# Altium project ControlBoard.PrjPcb (part 2 of 8)

## Sheet CAN.SchDoc: Title
size A4; SchTemplateVer: V2.0; Author: Adam Mizerkiewicz; CompanyName: Adam Mizerkiewicz; DrawnBy: Adam Mizerkiewicz; Engineer: Adam Mizerkiewicz; Organization: Adam Mizerkiewicz; Address1: Sarnia 2/19; Address2: 61-058 Poznań; Revision: 0.0; SheetNumber: 12; SheetTotal: 18
Used 2 times, as channels TOP/U_CAN, TOP/U_CAN. Parts and nets are listed once, with the designators drawn on the sheet.
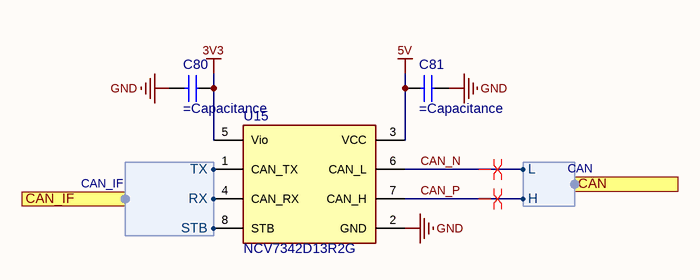
[diagram p4: CAN.SchDoc]

### Parts
C80  (no value)  [C0402]
C81  (no value)  [C0402]
U15  NCV7342D13R2G  [SOIC8]

### Ports
CAN (harness CAN), CAN_IF (harness CAN_IF)

### Harnesses
CAN_IF: RX, TX, STB
CAN: H, L

### Nets
3V3: C80.1 U15.5(Vio)
5V: C81.2 U15.3(VCC)
GND: C80.2 C81.1 U15.2(GND)
CAN_N: U15.6(CAN_L) ; port CAN.L
CAN_P: U15.7(CAN_H) ; port CAN.H
NetU15_1: U15.1(CAN_TX) ; port CAN_IF.TX
NetU15_4: U15.4(CAN_RX) ; port CAN_IF.RX
NetU15_8: U15.8(STB) ; port CAN_IF.STB

### Channels
TOP/U_CAN: designators end in _TOP_U_CAN#1
TOP/U_CAN: designators end in _TOP_U_CAN#2

### Layout directives
differential pair; differential pair class CAN: CAN_N, CAN_P

### Notes on the sheet
- Revision
  =Revision
- Sheet
  =SheetNumber / =SheetTotal

### Library data of the parts
C80 C81 = CAP0402-0.1uF-50V: CAP CER 0.1UF 50V X7R 0402; Manufacturer: Walsin Technologies; Manufacturer Part Number: 0402B104K500CT; Capacitance: 100nF; Material: 4241ConductorMaterial; Value: 100nF; Tolerance: 10%; Dielectric: 1511DielectricType; Supplier: Digikey; Supplier Part Number: 1292-1176-1-ND; RoHS: Yes; Category: Ceramic Capacitors; Stock: 109567; Pricing: 1=0,08, 10=0,005, 100=0,0032, 1000=0,0024 (USD); Mounting Technology: Surface Mount; Case/Package: 0402; Case Code (Imperial): 0402; Case Code (Metric): 1005; Min Operating Temperature: -55°C; Max Operating Temperature: 125°C; Packaging: Cut Tape; Voltage Rating: 50V; Series: -; Voltage Rating (DC): 50V; Height: 550um; RoHS Compliant: Yes; Lead Free: 5697LeadFree; ComponentLink1URL: http://datasheet.octopart.com/0402B104K500CT-Walsin-Technologies-datasheet-26371553.pdf?src-supplier=Arrow+Electronics; ComponentLink1Description: http://datasheet.octopart.com/0402B104K500CT-Walsin-Technologies-datasheet-26371553.pdf?src-supplier=Arrow+Electronics; ComponentLink2URL: http://datasheet.octopart.com/0402B104K500CT-Walsin-Technologies-datasheet-26371553.pdf?src-supplier=Verical; ComponentLink2Description: http://datasheet.octopart.com/0402B104K500CT-Walsin-Technologies-datasheet-26371553.pdf?src-supplier=Verical; ComponentLink3URL: http://www.passivecomponent.com/indexsea/0402B104K500CT-IE.pdf?src-supplier=Digikey; ComponentLink3Description: http://www.passivecomponent.com/indexsea/0402B104K500CT-IE.pdf?src-supplier=Digikey; ComponentLink4URL: http://datasheet.octopart.com/0402B104K500CT-Walsin-Technologies-datasheet-26371553.pdf?src-supplier=Rs; ComponentLink4Description: http://datasheet.octopart.com/0402B104K500CT-Walsin-Technologies-datasheet-26371553.pdf?src-supplier=Rs; ComponentLink5URL: https://datasheet.octopart.com/0402B104K500CT-Walsin-Technologies-datasheet-128065749.pdf?src-supplier=Future+Electronics; ComponentLink5Description: https://datasheet.octopart.com/0402B104K500CT-Walsin-Technologies-datasheet-128065749.pdf?src-supplier=Future+Electronics; ComponentLink6URL: http://datasheet.octopart.com/0402B104K500CT-Walsin-Technologies-datasheet-26371553.pdf?src-supplier=Farnell; ComponentLink6Description: http://datasheet.octopart.com/0402B104K500CT-Walsin-Technologies-datasheet-26371553.pdf?src-supplier=Farnell; ComponentLink7URL: http://datasheet.octopart.com/0402B104K500CT-Walsin-Technologies-datasheet-26371553.pdf?src-supplier=Newark; ComponentLink7Description: http://datasheet.octopart.com/0402B104K500CT-Walsin-Technologies-datasheet-26371553.pdf?src-supplier=Newark; ComponentLink8URL: http://datasheet.octopart.com/0402B104K500CT-Walsin-Technologies-datasheet-26371553.pdf?src-supplier=Mouser; ComponentLink8Description: http://datasheet.octopart.com/0402B104K500CT-Walsin-Technologies-datasheet-26371553.pdf?src-supplier=Mouser; ComponentLink9URL: http://datasheet.octopart.com/0402B104K500CT-Walsin-Technologies-datasheet-26371553.pdf?src-supplier=Digikey; ComponentLink9Description: http://datasheet.octopart.com/0402B104K500CT-Walsin-Technologies-datasheet-26371553.pdf?src-supplier=Digikey; ComponentLink10URL: https://datasheet.octopart.com/0402B104K500CT-Walsin-Technologies-datasheet-62066062.pdf?src-supplier=TME; ComponentLink10Description: https://datasheet.octopart.com/0402B104K500CT-Walsin-Technologies-datasheet-62066062.pdf?src-supplier=TME; ComponentLink11URL: http://datasheet.octopart.com/0402B104K500CT-Walsin-Technologies-datasheet-26371553.pdf?src-supplier=Freelance+Electronics; ComponentLink11Description: http://datasheet.octopart.com/0402B104K500CT-Walsin-Technologies-datasheet-26371553.pdf?src-supplier=Freelance+Electronics; ComponentLink12URL: http://datasheet.octopart.com/0402B104K500CT-Walsin-Technologies-datasheet-26371553.pdf?src-supplier=Component+Sense; ComponentLink12Description: http://datasheet.octopart.com/0402B104K500CT-Walsin-Technologies-datasheet-26371553.pdf?src-supplier=Component+Sense; ComponentLink13URL: http://datasheet.octopart.com/0402B104K500CT-Walsin-Technologies-datasheet-26371553.pdf?src-supplier=NAC+Semi; ComponentLink13Description: http://datasheet.octopart.com/0402B104K500CT-Walsin-Technologies-datasheet-26371553.pdf?src-supplier=NAC+Semi; ComponentLink14URL: https://datasheet.octopart.com/0402B104K500CT-Walsin-Technologies-datasheet-136037192.pdf?src-supplier=TECHDesign; ComponentLink14Description: https://datasheet.octopart.com/0402B104K500CT-Walsin-Technologies-datasheet-136037192.pdf?src-supplier=TECHDesign; Supplier 1: Digikey; Supplier Part Number 1: 1292-1176-1-ND
U15 = NCV7342D13R2G: IC TRANSCEIVER HALF 1/1 8SOIC; Manufacturer: ON Semiconductor; Data Rate: 1Mbps; Max Supply Voltage: 5.5V; Min Supply Voltage: 4.5V; Number of Transceivers: 1; Supplier 1: Digi-Key; Manufacturer Part Number: NCV7342D13R2G; RoHS: Yes; Category: Interface ICs; Pricing 1: 1=0.95000, 10=0.85000, 25=0.80680, 100=0.66290, 250=0.61968, 500=0.54760, 1000=0.47582 (USD); Mount: Surface Mount; Case/Package: SOIC; Number of Pins: 8; Min Operating Temperature: -40°C; Max Operating Temperature: 125°C; Packaging: Tape and Reel; Package Quantity: 3000; Lead Free: Lead Free; RoHS Compliant: Yes; ComponentLink1URL: http://www.farnell.com/datasheets/2160795.pdf?src-supplier=Farnell; ComponentLink1Description: http://www.farnell.com/datasheets/2160795.pdf?src-supplier=Farnell; ComponentLink2URL: http://www.mouser.com/ds/2/308/NCV7342-D-269211.pdf?src-supplier=Mouser; ComponentLink2Description: http://www.mouser.com/ds/2/308/NCV7342-D-269211.pdf?src-supplier=Mouser; ComponentLink3URL: http://www.onsemi.com/pub/Collateral/NCV7342-D.PDF?src-supplier=Digi-Key; ComponentLink3Description: http://www.onsemi.com/pub/Collateral/NCV7342-D.PDF?src-supplier=Digi-Key; ComponentLink4URL: http://www.onsemi.com/pub_link/Collateral/NCV7342-D.PDF?src-supplier=Avnet; ComponentLink4Description: http://www.onsemi.com/pub_link/Collateral/NCV7342-D.PDF?src-supplier=Avnet; ComponentLink5URL: http://www.farnell.com/datasheets/2160795.pdf?src-supplier=Newark; ComponentLink5Description: http://www.farnell.com/datasheets/2160795.pdf?src-supplier=Newark; ComponentLink6URL: http://www.farnell.com/datasheets/2160795.pdf?src-supplier=Element14; ComponentLink6Description: http://www.farnell.com/datasheets/2160795.pdf?src-supplier=Element14; Supplier Part Number 1: NCV7342D13R2GOSCT-ND

## Sheet DIgitalInputs.SchDoc: Title
size A4; SchTemplateVer: V2.0; Author: Adam Mizerkiewicz; CompanyName: Adam Mizerkiewicz; DrawnBy: Adam Mizerkiewicz; Engineer: Adam Mizerkiewicz; Organization: Adam Mizerkiewicz; Address1: Sarnia 2/19; Address2: 61-058 Poznań; Revision: 0.0; SheetNumber: 7; SheetTotal: 17
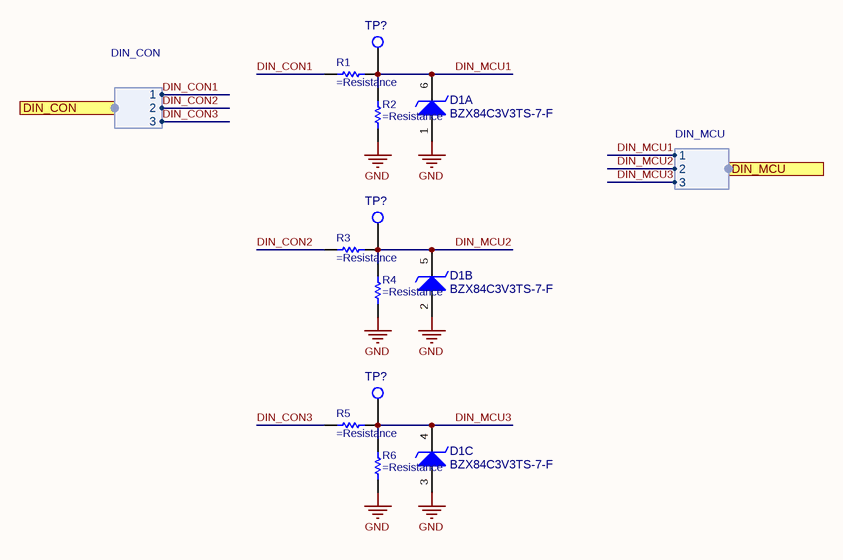
[diagram p5: DIgitalInputs.SchDoc]

### Parts
(Parts that share a designator on the sheet are numbered #1, #2 ... from top to bottom, then left to right.)
D1  BZX84C3V3TS-7-F  [SOT-363]  (parts A,B,C of 3)
R1  (no value)  [R0402]
R2  (no value)  [R0402]
R3  (no value)  [R0402]
R4  (no value)  [R0402]
R5  (no value)  [R0402]
R6  (no value)  [R0402]
TP?#1  TP_SMT  [TP_SMT]  (value not drawn)  (no BOM)
TP?#2  TP_SMT  [TP_SMT]  (value not drawn)  (no BOM)
TP?#3  TP_SMT  [TP_SMT]  (value not drawn)  (no BOM)

### Ports
DIN_CON (harness DIN_CON), DIN_MCU (harness DIN_MCU)

### Harnesses
DIN_MCU: 1, 2, 3
DIN_CON: 1, 2, 3

### Nets
GND: D1.1(A1) D1.2(A2) D1.3(A3) R2.1 R4.1 R6.1
DIN_CON1: R1.1 ; port DIN_CON.1
DIN_CON2: R3.1 ; port DIN_CON.2
DIN_CON3: R5.1 ; port DIN_CON.3
DIN_MCU1: D1.6(C1) R1.2 R2.2 TP?#1.1 ; port DIN_MCU.1
DIN_MCU2: D1.5(C2) R3.2 R4.2 TP?#2.1 ; port DIN_MCU.2
DIN_MCU3: D1.4(C3) R5.2 R6.2 TP?#3.1 ; port DIN_MCU.3

### Notes on the sheet
- Revision
  =Revision
- Sheet
  =SheetNumber / =SheetTotal

### Library data of the parts
D1 = BZX84C3V3TS-7-F: DIODE ZENER ARRAY 3.3V SOT-363; Manufacturer: Diodes Inc.; ESD Protection: No; Forward Voltage: 900mV; Impedance: 95Ω; Max Power Dissipation: 200mW; Max Reverse Leakage Current: 5µA; Number of Elements: 3; Polarity: Unidirectional; Reverse Standoff Voltage: 1V; Test Current: 5mA; Tolerance: 6%; Voltage Tolerance: 6.06%; Supplier 1: DigiKey; Supplier Part Number 1: 31-BZX84C3V3TS-7-FCT-ND; Supplier: DigiKey; Supplier Part Number: 31-BZX84C3V3TS-7-FCT-ND; Manufacturer Part Number: BZX84C3V3TS-7-F; RoHS: Compliant; Category: Zener Diodes; Stock: 2827; Pricing: 1=0,31, 10=0,213, 100=0,099 (USD); Case/Package: SOT-363; China RoHS: Compliant; Contact Plating: Tin; Height: 1mm; Length: 2.2mm; Lifecycle Status: Production; Max Operating Temperature: 150°C; Min Operating Temperature: -65°C; Mounting Technology: Surface Mount; Pins: 6; Number of Terminals: 6; Packaging: Tape & Reel; Peak Reverse Current: 5µA; Power Dissipation: 200mW; Power Rating: 200mW; REACH SVHC: Yes; Reference Voltage: 3.3V; Weight: 6.010099mg; Width: 2.2mm; Zener Current: 5mA; Zener Voltage: 3.3V; ComponentLink1URL: https://datasheet.octopart.com:443/BZX84C3V3TS-7-F-Diodes-Inc.-datasheet-160640132.pdf?src-supplier=IHS; ComponentLink1Description: https://datasheet.octopart.com:443/BZX84C3V3TS-7-F-Diodes-Inc.-datasheet-160640132.pdf?src-supplier=IHS; ComponentLink2URL: https://datasheet.octopart.com:443/BZX84C3V3TS-7-F-Diodes-Inc.-datasheet-11551317.pdf?src-supplier=Diodes+Inc+SCT; ComponentLink2Description: https://datasheet.octopart.com:443/BZX84C3V3TS-7-F-Diodes-Inc.-datasheet-11551317.pdf?src-supplier=Diodes+Inc+SCT; ComponentLink3URL: https://sigma.octopart.com:443/138865995/technical_drawing/Diodes-Inc.-BZX84C3V3TS-7-F.pdf?src-supplier=Diodes+Inc+SCT; ComponentLink3Description: https://sigma.octopart.com:443/138865995/technical_drawing/Diodes-Inc.-BZX84C3V3TS-7-F.pdf?src-supplier=Diodes+Inc+SCT; ComponentLink4URL: http://sigma.octopart.com:80/15616913/materials_sheet/Diodes-Inc.-BZX84C3V3TS-7-F.pdf?src-supplier=Compliance+Statements; ComponentLink4Description: http://sigma.octopart.com:80/15616913/materials_sheet/Diodes-Inc.-BZX84C3V3TS-7-F.pdf?src-supplier=Compliance+Statements
R1-R6 = RES0402-30k-1%: 0402 30K Ohms 1% High Power Thick Film Surface Mount Chip Resistor; Manufacturer: Vishay; Manufacturer Part Number: CRCW040230K0FKEDHP; Manufacturer Package Identifier: CRCW0402-HPe3; Resistance: 30kΩ; Max Power Dissipation: 125mW; Power Dissipation: 200mW; Value: 30kΩ; Temperature Coefficient: 100ppm/°C; Voltage Rating: 50V; Supplier 1: DigiKey; Supplier Part Number 1: CRCW040230K0FKEDHPCT-ND; Supplier: DigiKey; Supplier Part Number: CRCW040230K0FKEDHPCT-ND; RoHS: Compliant; Category: Chip SMD Resistors; Stock: 9449; Pricing: 1=0,13, 10=0,061, 25=0,0472, 50=0,0392, 100=0,0331, 250=0,027, 500=0,0235, 1000=0,02072, 5000=0,01631 (USD); Case/Package: 0402; Case Code (Imperial): 0402; Case Code (Metric): 1005; China RoHS: Non-Compliant; Composition: Thick Film; Contact Plating: Tin; Features: Automotive AEC-Q200; Height: 300µm; Lead Free: Lead Free; Length: 990.6µm; Lifecycle Status: Production; Max Operating Temperature: 155°C; Min Operating Temperature: -55°C; Mounting Technology: Surface Mount; Number of Terminals: 2; Number of Terminations: 2; Packaging: Digi-Reel®; Power Rating: 200mW; Radiation Hardening: No; REACH SVHC: Yes; Tolerance: 1%; Width: 500µm; Working Voltage: 50V; ComponentLink1URL: https://datasheet.octopart.com/CRCW040230K0FKEDHP-Vishay-datasheet-83567917.pdf; ComponentLink1Description: https://datasheet.octopart.com/CRCW040230K0FKEDHP-Vishay-datasheet-83567917.pdf; ComponentLink2URL: https://datasheet.octopart.com/D-CRCW-e3-Standard-Thick-Film-Chip-Resistors-Vishay-datasheet-family-64.pdf; ComponentLink2Description: https://datasheet.octopart.com/D-CRCW-e3-Standard-Thick-Film-Chip-Resistors-Vishay-datasheet-family-64.pdf; ComponentLink3URL: https://datasheet.octopart.com:443/CRCW040230K0FKEDHP-Vishay-datasheet-137113427.pdf?src-supplier=X-ON; ComponentLink3Description: https://datasheet.octopart.com:443/CRCW040230K0FKEDHP-Vishay-datasheet-137113427.pdf?src-supplier=X-ON; ComponentLink4URL: https://datasheet.octopart.com:443/CRCW040230K0FKEDHP-Vishay-datasheet-62316122.pdf?src-supplier=Future+Electronics; ComponentLink4Description: https://datasheet.octopart.com:443/CRCW040230K0FKEDHP-Vishay-datasheet-62316122.pdf?src-supplier=Future+Electronics; ComponentLink5URL: http://sigma.octopart.com:80/rohs_certificate/D-CRCW-e3-Standard-Thick-Film-Chip-Resistors-Vishay-family-102.pdf?src-supplier=Compliance+Statements; ComponentLink5Description: http://sigma.octopart.com:80/rohs_certificate/D-CRCW-e3-Standard-Thick-Film-Chip-Resistors-Vishay-family-102.pdf?src-supplier=Compliance+Statements
TP?#1-TP?#3 = TP: TEST POINT

## Sheet DigitalOutputs.SchDoc: Title
size A4; SchTemplateVer: V2.0; Author: Adam Mizerkiewicz; CompanyName: Adam Mizerkiewicz; DrawnBy: Adam Mizerkiewicz; Engineer: Adam Mizerkiewicz; Organization: Adam Mizerkiewicz; Address1: Sarnia 2/19; Address2: 61-058 Poznań; Revision: 0.0
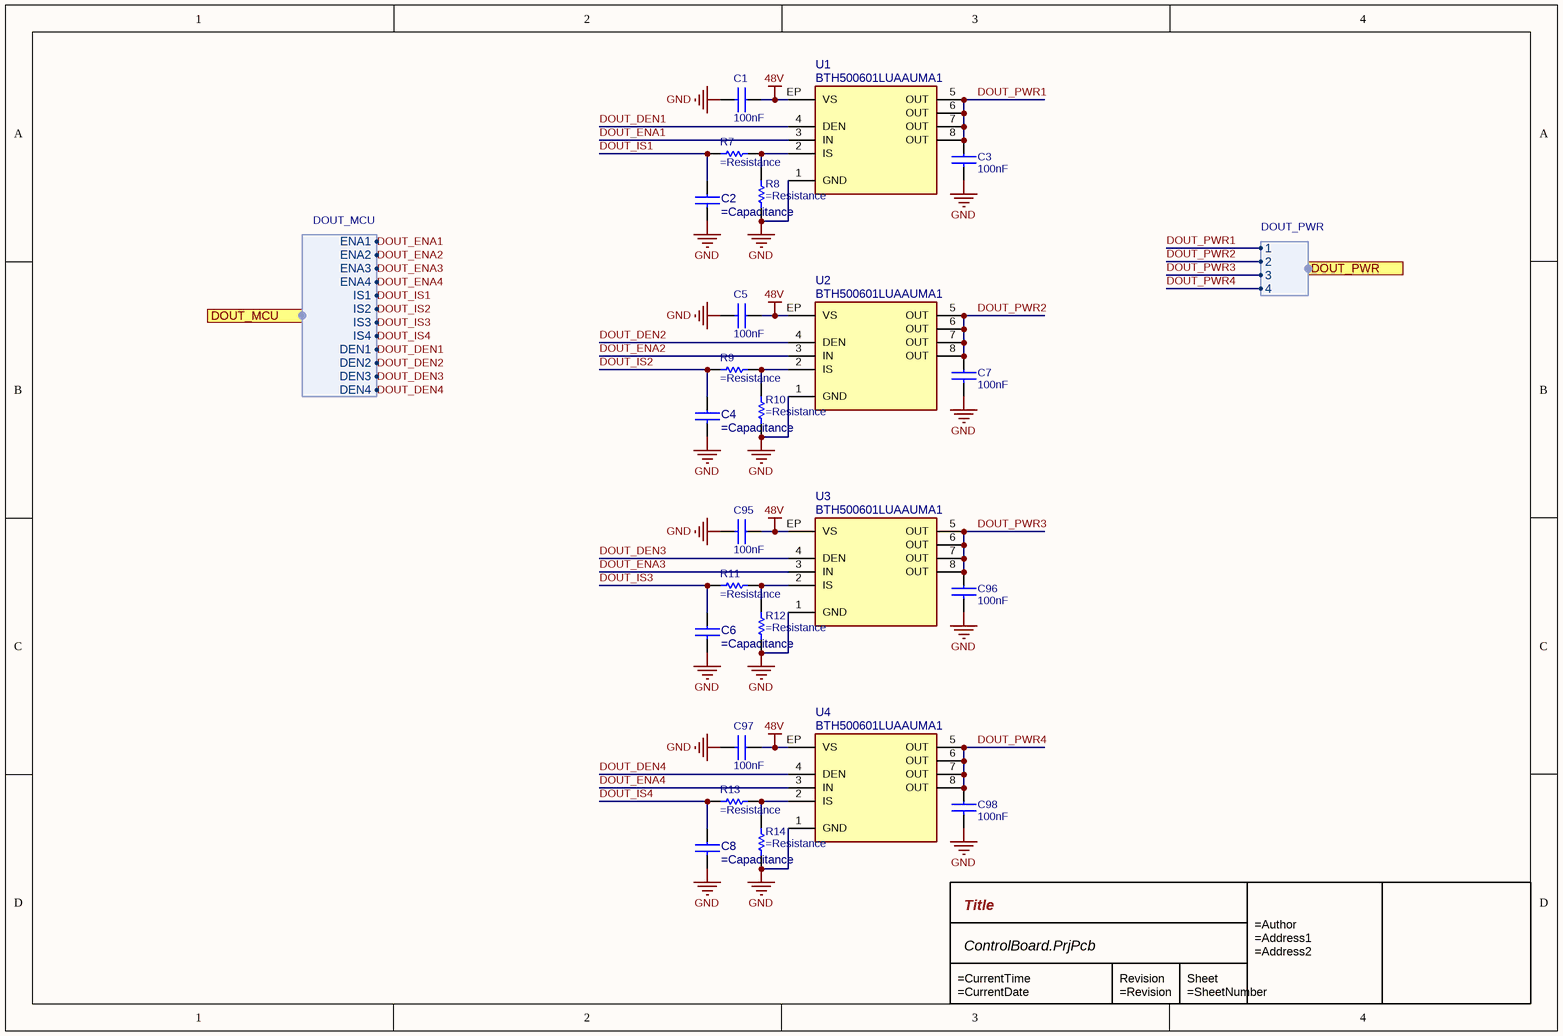
[diagram p6: DigitalOutputs.SchDoc]

### Parts
C1  100nF  [C0603]
C2  (no value)  [C0402]
C3  100nF  [C0603]
C4  (no value)  [C0402]
C5  100nF  [C0603]
C6  (no value)  [C0402]
C7  100nF  [C0603]
C8  (no value)  [C0402]
C95  100nF  [C0603]
C96  100nF  [C0603]
C97  100nF  [C0603]
C98  100nF  [C0603]
R7  (no value)  [R0402]
R8  (no value)  [R0402]
R9  (no value)  [R0402]
R10  (no value)  [R0402]
R11  (no value)  [R0402]
R12  (no value)  [R0402]
R13  (no value)  [R0402]
R14  (no value)  [R0402]
U1  BTH500601LUAAUMA1  [PG-HSOF-8-1]
U2  BTH500601LUAAUMA1  [PG-HSOF-8-1]
U3  BTH500601LUAAUMA1  [PG-HSOF-8-1]
U4  BTH500601LUAAUMA1  [PG-HSOF-8-1]

### Ports
DOUT_MCU (harness DOUT_MCU), DOUT_PWR (harness DOUT_PWR)

### Harnesses
DOUT_MCU: ENA1, DEN1, ENA2, ENA3, ENA4, IS1, IS2, IS3, IS4, DEN2, DEN3, DEN4
DOUT_PWR: 1, 2, 3, 4

### Nets
48V: C1.1 C5.1 C95.1 C97.1 U1.EP(VS) U2.EP(VS) U3.EP(VS) U4.EP(VS)
GND: C1.2 C2.2 C3.2 C4.2 C5.2 C6.2 C7.2 C8.2 C95.2 C96.2 C97.2 C98.2 R8.1 R10.1 R12.1 R14.1 U1.1(GND) U2.1(GND) U3.1(GND) U4.1(GND)
DOUT_DEN1: U1.4(DEN) ; port DOUT_MCU.DEN1
DOUT_DEN2: U2.4(DEN) ; port DOUT_MCU.DEN2
DOUT_DEN3: U3.4(DEN) ; port DOUT_MCU.DEN3
DOUT_DEN4: U4.4(DEN) ; port DOUT_MCU.DEN4
DOUT_ENA1: U1.3(IN) ; port DOUT_MCU.ENA1
DOUT_ENA2: U2.3(IN) ; port DOUT_MCU.ENA2
DOUT_ENA3: U3.3(IN) ; port DOUT_MCU.ENA3
DOUT_ENA4: U4.3(IN) ; port DOUT_MCU.ENA4
DOUT_IS1: C2.1 R7.1 ; port DOUT_MCU.IS1
DOUT_IS2: C4.1 R9.1 ; port DOUT_MCU.IS2
DOUT_IS3: C6.1 R11.1 ; port DOUT_MCU.IS3
DOUT_IS4: C8.1 R13.1 ; port DOUT_MCU.IS4
DOUT_PWR1: C3.1 U1.5(OUT) U1.6(OUT) U1.7(OUT) U1.8(OUT) ; port DOUT_PWR.1
DOUT_PWR2: C7.1 U2.5(OUT) U2.6(OUT) U2.7(OUT) U2.8(OUT) ; port DOUT_PWR.2
DOUT_PWR3: C96.1 U3.5(OUT) U3.6(OUT) U3.7(OUT) U3.8(OUT) ; port DOUT_PWR.3
DOUT_PWR4: C98.1 U4.5(OUT) U4.6(OUT) U4.7(OUT) U4.8(OUT) ; port DOUT_PWR.4
NetR7_2: R7.2 R8.2 U1.2(IS)
NetR9_2: R9.2 R10.2 U2.2(IS)
NetR11_2: R11.2 R12.2 U3.2(IS)
NetR13_2: R13.2 R14.2 U4.2(IS)

### Notes on the sheet
- Revision
  =Revision
- Sheet
  =SheetNumber / =SheetTotal

### Library data of the parts
C1 C3 C5 C7 C95-C98 = CAP0603-0.1uF-100V: CAP CER 0.1UF 100V X7R 0603; Manufacturer: Yageo; Manufacturer Part Number: CC0603KRX7R0BB104; Material: 4241ConductorMaterial; Tolerance: 10%; Capacitance: 100nF; Supplier: Digikey; Supplier Part Number: 311-1523-1-ND; RoHS: Yes; Category: Ceramic Capacitors; Stock: 3495882; Pricing: 1=0,14, 10=0,079, 100=0,0484, 1000=0,0325 (USD); Mounting Technology: Surface Mount; Case/Package: 0603; Case Code (Metric): 1608; Case Code (Imperial): 0603; Weight: 7.1E-05oz; Min Operating Temperature: -55°C; Max Operating Temperature: 125°C; Value: 100nF; Voltage Rating: 100V; Packaging: Tape and Reel; Dielectric: X7R; Termination: SMD/SMT; Voltage Rating (DC): 100V; Package Quantity: 4000; Series: CC; Length: 0.063inch; Width: 0.031inch; Height: 900um; Thickness: 0.035inch; Lead Free: 5697LeadFree; RoHS Compliant: Yes; ComponentLink1URL: https://datasheet.ciiva.com/6277/mlccorderingcode-6277082.pdf?src-supplier=Digikey; ComponentLink1Description: https://datasheet.ciiva.com/6277/mlccorderingcode-6277082.pdf?src-supplier=Digikey; ComponentLink2URL: https://datasheet.ciiva.com/6277/mlccorderingcode-6277081.pdf?src-supplier=Digikey; ComponentLink2Description: https://datasheet.ciiva.com/6277/mlccorderingcode-6277081.pdf?src-supplier=Digikey; ComponentLink3URL: https://datasheet.ciiva.com/6277/mlccorderingcode-6277030.pdf?src-supplier=Digikey; ComponentLink3Description: https://datasheet.ciiva.com/6277/mlccorderingcode-6277030.pdf?src-supplier=Digikey; Supplier 1: Digikey; Supplier Part Number 1: 311-1523-1-ND
C2 C4 C6 C8 = CAP0402-0.1uF-50V: as C80 on sheet CAN; Supplier: Digikey; Supplier Part Number: 1292-1176-1-ND; RoHS: Yes; Category: Ceramic Capacitors; Stock: 109567; Pricing: 1=0,08, 10=0,005, 100=0,0032, 1000=0,0024 (USD); Mounting Technology: Surface Mount; Case/Package: 0402; Case Code (Imperial): 0402; Case Code (Metric): 1005; Min Operating Temperature: -55°C; Max Operating Temperature: 125°C; Packaging: Cut Tape; Voltage Rating: 50V; Series: -; Voltage Rating (DC): 50V; Height: 550um; RoHS Compliant: Yes; Lead Free: 5697LeadFree; ComponentLink1URL: http://datasheet.octopart.com/0402B104K500CT-Walsin-Technologies-datasheet-26371553.pdf?src-supplier=Arrow+Electronics; ComponentLink1Description: http://datasheet.octopart.com/0402B104K500CT-Walsin-Technologies-datasheet-26371553.pdf?src-supplier=Arrow+Electronics; ComponentLink2URL: http://datasheet.octopart.com/0402B104K500CT-Walsin-Technologies-datasheet-26371553.pdf?src-supplier=Verical; ComponentLink2Description: http://datasheet.octopart.com/0402B104K500CT-Walsin-Technologies-datasheet-26371553.pdf?src-supplier=Verical; ComponentLink3URL: http://www.passivecomponent.com/indexsea/0402B104K500CT-IE.pdf?src-supplier=Digikey; ComponentLink3Description: http://www.passivecomponent.com/indexsea/0402B104K500CT-IE.pdf?src-supplier=Digikey; ComponentLink4URL: http://datasheet.octopart.com/0402B104K500CT-Walsin-Technologies-datasheet-26371553.pdf?src-supplier=Rs; ComponentLink4Description: http://datasheet.octopart.com/0402B104K500CT-Walsin-Technologies-datasheet-26371553.pdf?src-supplier=Rs; ComponentLink5URL: https://datasheet.octopart.com/0402B104K500CT-Walsin-Technologies-datasheet-128065749.pdf?src-supplier=Future+Electronics; ComponentLink5Description: https://datasheet.octopart.com/0402B104K500CT-Walsin-Technologies-datasheet-128065749.pdf?src-supplier=Future+Electronics; ComponentLink6URL: http://datasheet.octopart.com/0402B104K500CT-Walsin-Technologies-datasheet-26371553.pdf?src-supplier=Farnell; ComponentLink6Description: http://datasheet.octopart.com/0402B104K500CT-Walsin-Technologies-datasheet-26371553.pdf?src-supplier=Farnell; ComponentLink7URL: http://datasheet.octopart.com/0402B104K500CT-Walsin-Technologies-datasheet-26371553.pdf?src-supplier=Newark; ComponentLink7Description: http://datasheet.octopart.com/0402B104K500CT-Walsin-Technologies-datasheet-26371553.pdf?src-supplier=Newark; ComponentLink8URL: http://datasheet.octopart.com/0402B104K500CT-Walsin-Technologies-datasheet-26371553.pdf?src-supplier=Mouser; ComponentLink8Description: http://datasheet.octopart.com/0402B104K500CT-Walsin-Technologies-datasheet-26371553.pdf?src-supplier=Mouser; ComponentLink9URL: http://datasheet.octopart.com/0402B104K500CT-Walsin-Technologies-datasheet-26371553.pdf?src-supplier=Digikey; ComponentLink9Description: http://datasheet.octopart.com/0402B104K500CT-Walsin-Technologies-datasheet-26371553.pdf?src-supplier=Digikey; ComponentLink10URL: https://datasheet.octopart.com/0402B104K500CT-Walsin-Technologies-datasheet-62066062.pdf?src-supplier=TME; ComponentLink10Description: https://datasheet.octopart.com/0402B104K500CT-Walsin-Technologies-datasheet-62066062.pdf?src-supplier=TME; ComponentLink11URL: http://datasheet.octopart.com/0402B104K500CT-Walsin-Technologies-datasheet-26371553.pdf?src-supplier=Freelance+Electronics; ComponentLink11Description: http://datasheet.octopart.com/0402B104K500CT-Walsin-Technologies-datasheet-26371553.pdf?src-supplier=Freelance+Electronics; ComponentLink12URL: http://datasheet.octopart.com/0402B104K500CT-Walsin-Technologies-datasheet-26371553.pdf?src-supplier=Component+Sense; ComponentLink12Description: http://datasheet.octopart.com/0402B104K500CT-Walsin-Technologies-datasheet-26371553.pdf?src-supplier=Component+Sense; ComponentLink13URL: http://datasheet.octopart.com/0402B104K500CT-Walsin-Technologies-datasheet-26371553.pdf?src-supplier=NAC+Semi; ComponentLink13Description: http://datasheet.octopart.com/0402B104K500CT-Walsin-Technologies-datasheet-26371553.pdf?src-supplier=NAC+Semi; ComponentLink14URL: https://datasheet.octopart.com/0402B104K500CT-Walsin-Technologies-datasheet-136037192.pdf?src-supplier=TECHDesign; ComponentLink14Description: https://datasheet.octopart.com/0402B104K500CT-Walsin-Technologies-datasheet-136037192.pdf?src-supplier=TECHDesign; Supplier 1: Digikey; Supplier Part Number 1: 1292-1176-1-ND
R7 R9 R11 R13 = RES0402-1k-1%: Res Thick Film 0402 1K Ohm 1% 0.063W(1/16W) ±50ppm/C Pad SMD Automotive T/R; Manufacturer: Vishay; Manufacturer Part Number: CRCW04021K00FHEDP; Resistance: 1kΩ; Max Power Dissipation: 63mW; Value: 1kΩ; Temperature Coefficient: 50ppm/°C; Voltage Rating: 50V; Supplier 1: DigiKey; Supplier Part Number 1: CRCW04021K00FHEDP-ND; Supplier: DigiKey; Supplier Part Number: CRCW04021K00FHEDP-ND; RoHS: Compliant; Category: Chip SMD Resistors; Pricing: 10000=0,03252 (USD); Case/Package: 0402; China RoHS: Non-Compliant; Composition: Thick Film; Contact Plating: Tin; Depth: 500µm; Features: Automotive AEC-Q200; Height: 350µm; Length: 990.6µm; Lifecycle Status: Production; Max Operating Temperature: 155°C; Military Standard: Not; Min Operating Temperature: -55°C; Mounting Technology: Surface Mount; Number of Terminals: 2; Number of Terminations: 2; Packaging: Tape & Reel; Power Dissipation: 63mW; Power Rating: 63mW; Radiation Hardening: No; REACH SVHC: Yes; Tolerance: 1%; Width: 500µm; Working Voltage: 50V; ComponentLink1URL: https://datasheet.octopart.com:443/CRCW04021K00FHEDP-Vishay-datasheet-182027415.pdf?src-supplier=IHS; ComponentLink1Description: https://datasheet.octopart.com:443/CRCW04021K00FHEDP-Vishay-datasheet-182027415.pdf?src-supplier=IHS; ComponentLink2URL: https://datasheet.octopart.com:443/CRCW04021K00FHEDP-Vishay-Dale-datasheet-141207190.pdf?src-supplier=Upverter; ComponentLink2Description: https://datasheet.octopart.com:443/CRCW04021K00FHEDP-Vishay-Dale-datasheet-141207190.pdf?src-supplier=Upverter; ComponentLink3URL: http://sigma.octopart.com:80/rohs_statement/Vishay-company-15.pdf?src-supplier=Compliance+Statements; ComponentLink3Description: http://sigma.octopart.com:80/rohs_statement/Vishay-company-15.pdf?src-supplier=Compliance+Statements
R8 R10 R12 R14 = RES0402-2k-1%: Res Thick Film 0402 2K Ohm 1% 1/16W 100ppm/C Molded SMD SMD Paper T/R; Manufacturer: Vishay; Manufacturer Part Number: CRCW04022K00FKEE; Resistance: 2kΩ; Max Power Dissipation: 63mW; Value: 2kΩ; Temperature Coefficient: 100ppm/°C; Voltage Rating: 50V; Supplier 1: DigiKey; Supplier Part Number 1: 541-CRCW04022K00FKEECT-ND; Supplier: DigiKey; Supplier Part Number: 541-CRCW04022K00FKEECT-ND; RoHS: Compliant; Category: Chip SMD Resistors; Stock: 10445; Pricing: 1=0,1, 10=0,03, 25=0,0224, 50=0,018, 100=0,0148, 250=0,01156, 500=0,01056, 1000=0,0084, 5000=0,00637 (USD); Case/Package: 0402; China RoHS: Non-Compliant; Composition: Thick Film; Contact Plating: Tin; Features: Automotive AEC-Q200; Height: 350µm; Lead Free: Lead Free; Length: 990.6µm; Lifecycle Status: Production; Max Operating Temperature: 155°C; Min Operating Temperature: -55°C; Mounting Technology: Surface Mount; Number of Terminals: 2; Number of Terminations: 2; Packaging: Tape & Reel; Power Dissipation: 63mW; Power Rating: 63mW; Radiation Hardening: No; REACH SVHC: Yes; Tolerance: 1%; Width: 500µm; Working Voltage: 50V; ComponentLink1URL: https://datasheet.octopart.com:443/CRCW04022K00FKEE-Vishay-datasheet-175423584.pdf?src-supplier=IHS; ComponentLink1Description: https://datasheet.octopart.com:443/CRCW04022K00FKEE-Vishay-datasheet-175423584.pdf?src-supplier=IHS; ComponentLink2URL: https://datasheet.octopart.com/D-CRCW-e3-Standard-Thick-Film-Chip-Resistors-Vishay-datasheet-family-64.pdf; ComponentLink2Description: https://datasheet.octopart.com/D-CRCW-e3-Standard-Thick-Film-Chip-Resistors-Vishay-datasheet-family-64.pdf; ComponentLink3URL: http://sigma.octopart.com:80/rohs_certificate/D-CRCW-e3-Standard-Thick-Film-Chip-Resistors-Vishay-family-102.pdf?src-supplier=Compliance+Statements; ComponentLink3Description: http://sigma.octopart.com:80/rohs_certificate/D-CRCW-e3-Standard-Thick-Film-Chip-Resistors-Vishay-family-102.pdf?src-supplier=Compliance+Statements
U1-U4 = BTH50060-1LUA: Power Load Sw, High Side, 150DEGC, HSOF8;; Manufacturer: Infineon; Supplier 1: DigiKey; Supplier Part Number 1: 448-BTH500601LUAAUMA1CT-ND; Supplier: DigiKey; Supplier Part Number: 448-BTH500601LUAAUMA1CT-ND; Manufacturer Part Number: BTH500601LUAAUMA1; Category: Power Switch ICs - Power Distribution; Stock: 3526; Pricing: 1=4,49, 10=3,408, 25=3,1372, 100=2,8399, 250=2,69812, 500=2,61266, 1000=2,54235 (USD); ComponentLink1URL: http://sigma.octopart.com:80/conflict_mineral_statement/Infineon-company-51.pdf?src-supplier=Compliance+Statements; ComponentLink1Description: http://sigma.octopart.com:80/conflict_mineral_statement/Infineon-company-51.pdf?src-supplier=Compliance+Statements

## Sheet ExternalConnectors.SchDoc: Title
size A4; SchTemplateVer: V2.0; Author: Adam Mizerkiewicz; CompanyName: Adam Mizerkiewicz; DrawnBy: Adam Mizerkiewicz; Engineer: Adam Mizerkiewicz; Organization: Adam Mizerkiewicz; Address1: Sarnia 2/19; Address2: 61-058 Poznań; Revision: 0.0
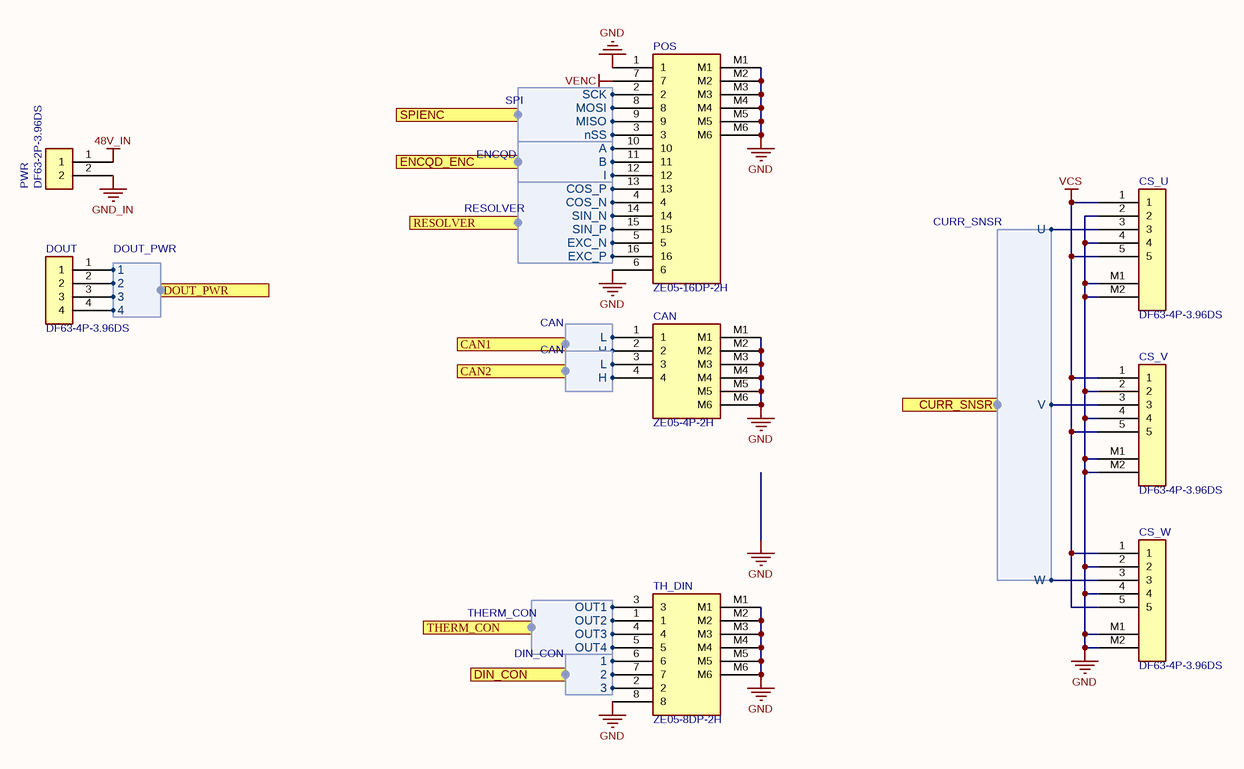
[diagram p7: ExternalConnectors.SchDoc]

### Parts
CAN  ZE05-4P-2H  [ZE05-4P-2H]
CS_U  DF63-4P-3.96DS  [FH34SRJ-5S-0.5SH(99)]
CS_V  DF63-4P-3.96DS  [FH34SRJ-5S-0.5SH(99)]
CS_W  DF63-4P-3.96DS  [FH34SRJ-5S-0.5SH(99)]
DOUT  DF63-4P-3.96DS  [HRS_DF63-4P-3.96DS]
POS  ZE05-16DP-2H  [ZE05-16DP-2H]
PWR  DF63-2P-3.96DS  [HRS_DF63-2P-3.96DS]
TH_DIN  ZE05-8DP-2H  [ZE05-8DP-2H]

### Ports
CAN1 (harness CAN), CAN2 (harness CAN), CURR_SNSR (harness CURR_SNSR), DIN_CON (harness DIN_CON), DOUT_PWR (harness DOUT_PWR), ENCQD_ENC (harness ENCQD), RESOLVER (harness RESOLVER), SPIENC (harness SPI), THERM_CON (harness THERM_CON)

### Harnesses
CAN: H, L
DOUT_PWR: 1, 2, 3, 4
ENCQD: B, A, I
SPI: MISO, MOSI, SCK, nSS
RESOLVER: EXC_P, EXC_N, SIN_P, SIN_N, COS_P, COS_N
CURR_SNSR: V, U, W
THERM_CON: OUT1, OUT2, OUT3, OUT4
DIN_CON: 1, 2, 3

### Nets
48V_IN: PWR.1
GND: CAN.M1 CAN.M2 CAN.M3 CAN.M4 CAN.M5 CAN.M6 CS_U.2 CS_U.4 CS_U.M1 CS_U.M2 CS_V.2 CS_V.4 CS_V.M1 CS_V.M2 CS_W.2 CS_W.4 CS_W.M1 CS_W.M2 POS.1 POS.6 POS.M1 POS.M2 POS.M3 POS.M4 POS.M5 POS.M6 TH_DIN.8 TH_DIN.M1 TH_DIN.M2 TH_DIN.M3 TH_DIN.M4 TH_DIN.M5 TH_DIN.M6
GND_IN: PWR.2
VCS: CS_U.1 CS_U.5 CS_V.1 CS_V.5 CS_W.1 CS_W.5
VENC: POS.7
CURR_SNSR_U: CS_U.3 ; port CURR_SNSR.U
CURR_SNSR_V: CS_V.3 ; port CURR_SNSR.V
CURR_SNSR_W: CS_W.3 ; port CURR_SNSR.W
DIN_CON1: TH_DIN.6 ; port DIN_CON.1
DIN_CON2: TH_DIN.7 ; port DIN_CON.2
DIN_CON3: TH_DIN.2 ; port DIN_CON.3
DOUT_PWR1: DOUT.1 ; port DOUT_PWR.1
DOUT_PWR2: DOUT.2 ; port DOUT_PWR.2
DOUT_PWR3: DOUT.3 ; port DOUT_PWR.3
DOUT_PWR4: DOUT.4 ; port DOUT_PWR.4
ENCQD_ENC_A: POS.10 ; port ENCQD_ENC.A
ENCQD_ENC_B: POS.11 ; port ENCQD_ENC.B
ENCQD_ENC_I: POS.12 ; port ENCQD_ENC.I
RES_COS_N: POS.4 ; port RESOLVER.COS_N
RES_COS_P: POS.13 ; port RESOLVER.COS_P
RES_EXC_N: POS.5 ; port RESOLVER.EXC_N
RES_EXC_P: POS.16 ; port RESOLVER.EXC_P
RES_SIN_N: POS.14 ; port RESOLVER.SIN_N
RES_SIN_P: POS.15 ; port RESOLVER.SIN_P
SPIENC_MISO: POS.9 ; port SPIENC.MISO
SPIENC_MOSI: POS.8 ; port SPIENC.MOSI
SPIENC_nSS: POS.3 ; port SPIENC.nSS
SPIENC_SCK: POS.2 ; port SPIENC.SCK
THERM_OUT1: TH_DIN.3 ; port THERM_CON.OUT1
THERM_OUT2: TH_DIN.1 ; port THERM_CON.OUT2
THERM_OUT3: TH_DIN.4 ; port THERM_CON.OUT3
THERM_OUT4: TH_DIN.5 ; port THERM_CON.OUT4
NetCAN_1: CAN.1 ; port CAN1.L
NetCAN_2: CAN.2 ; port CAN1.H
NetCAN_3: CAN.3 ; port CAN2.L
NetCAN_4: CAN.4 ; port CAN2.H

### Notes on the sheet
- Revision
  =Revision
- Sheet
  =SheetNumber / =SheetTotal

### Library data of the parts
CAN = ZE05-4P-2H: Automotive Connectors Right Angle Receptacle, DIP Solder Tabs, 4 Position; Manufacturer: HIROSE ELECTRIC; Supplier 1: DigiKey; Supplier Part Number 1: 26-ZE05-4P-2HCT-ND; Supplier: DigiKey; Supplier Part Number: 26-ZE05-4P-2HCT-ND; Manufacturer Part Number: ZE05-4P-2H; RoHS: Compliant; Category: Card Edge Connectors; Stock: 351; Pricing: 1=1,69, 10=1,434, 25=1,3444, 50=1,28, 100=1,2188 (USD); Connector Type: Receptacle; Contact Plating: Tin; Height: 8.34mm; Length: 16.32mm; Lifecycle Status: Production; Max Operating Temperature: 125°C; Min Operating Temperature: -40°C; Pins: 4; Orientation: Right Angle; REACH SVHC: Yes; Width: 14.8mm; ComponentLink1URL: https://datasheet.octopart.com:443/ZE05-4P-2H-HIROSE-ELECTRIC-datasheet-180012703.pdf?src-supplier=IHS; ComponentLink1Description: https://datasheet.octopart.com:443/ZE05-4P-2H-HIROSE-ELECTRIC-datasheet-180012703.pdf?src-supplier=IHS; ComponentLink2URL: https://datasheet.octopart.com:443/ZE05-4P-2H-HIROSE-ELECTRIC-datasheet-189101943.pdf?src-supplier=Master+Electronics; ComponentLink2Description: https://datasheet.octopart.com:443/ZE05-4P-2H-HIROSE-ELECTRIC-datasheet-189101943.pdf?src-supplier=Master+Electronics; ComponentLink3URL: https://datasheet.octopart.com:443/ZE05-4P-2H-HIROSE-ELECTRIC-datasheet-188748195.pdf?src-supplier=Master+Electronics; ComponentLink3Description: https://datasheet.octopart.com:443/ZE05-4P-2H-HIROSE-ELECTRIC-datasheet-188748195.pdf?src-supplier=Master+Electronics; ComponentLink4URL: https://datasheet.octopart.com:443/ZE05-4P-2H-HIROSE-ELECTRIC-datasheet-181928072.pdf?src-supplier=Electro+Sonic; ComponentLink4Description: https://datasheet.octopart.com:443/ZE05-4P-2H-HIROSE-ELECTRIC-datasheet-181928072.pdf?src-supplier=Electro+Sonic; ComponentLink5URL: https://datasheet.octopart.com:443/ZE05-4P-2H-HIROSE-ELECTRIC-datasheet-176457996.pdf?src-supplier=Future+Electronics; ComponentLink5Description: https://datasheet.octopart.com:443/ZE05-4P-2H-HIROSE-ELECTRIC-datasheet-176457996.pdf?src-supplier=Future+Electronics; ComponentLink6URL: https://datasheet.octopart.com:443/ZE05-4P-2H-Hirose-datasheet-168215454.pdf?src-supplier=TME; ComponentLink6Description: https://datasheet.octopart.com:443/ZE05-4P-2H-Hirose-datasheet-168215454.pdf?src-supplier=TME; ComponentLink7URL: https://datasheet.octopart.com:443/ZE05-4P-2H-Hirose-datasheet-149155786.pdf?src-supplier=Sager+Electronics; ComponentLink7Description: https://datasheet.octopart.com:443/ZE05-4P-2H-Hirose-datasheet-149155786.pdf?src-supplier=Sager+Electronics; ComponentLink8URL: https://datasheet.octopart.com:443/ZE05-4P-2H-Hirose-datasheet-137351164.pdf?src-supplier=Sager+Electronics; ComponentLink8Description: https://datasheet.octopart.com:443/ZE05-4P-2H-Hirose-datasheet-137351164.pdf?src-supplier=Sager+Electronics; ComponentLink9URL: https://sigma.octopart.com:443/145369994/technical_drawing/Hirose-ZE05-4P-2H.pdf?src-supplier=Hirose+SCT; ComponentLink9Description: https://sigma.octopart.com:443/145369994/technical_drawing/Hirose-ZE05-4P-2H.pdf?src-supplier=Hirose+SCT; ComponentLink10URL: https://datasheet.octopart.com:443/ZE05-4P-2H-Hirose-datasheet-141146741.pdf?src-supplier=Hirose+SCT; ComponentLink10Description: https://datasheet.octopart.com:443/ZE05-4P-2H-Hirose-datasheet-141146741.pdf?src-supplier=Hirose+SCT
CS_U CS_V CS_W = FH34SRJ-5S-0.5SH(99): RoHS Compliant Tape & Reel (TR) (Flat Flex Type) (Connector/Contact Type) Connector; Manufacturer: HIROSE ELECTRIC; Supplier 1: DigiKey; Supplier Part Number 1: FH34SRJ-5S-0.5SH(99)-ND; Supplier: DigiKey; Supplier Part Number: FH34SRJ-5S-0.5SH(99)-ND; Manufacturer Part Number: FH34SRJ-5S-0.5SH(99); RoHS: Compliant; Category: Card Edge Connectors; Pricing: 500=1,20602 (USD); Lifecycle Status: Production; REACH SVHC: Yes; ComponentLink1URL: https://datasheet.octopart.com:443/FH34SRJ-5S-0.5SH%2899%29-HIROSE-ELECTRIC-datasheet-151619939.pdf?src-supplier=IHS; ComponentLink1Description: https://datasheet.octopart.com:443/FH34SRJ-5S-0.5SH%2899%29-HIROSE-ELECTRIC-datasheet-151619939.pdf?src-supplier=IHS; ComponentLink2URL: https://datasheet.octopart.com:443/FH34SRJ-5S-0.5SH%2899%29-Hirose-datasheet-145364452.pdf?src-supplier=Hirose+SCT; ComponentLink2Description: https://datasheet.octopart.com:443/FH34SRJ-5S-0.5SH%2899%29-Hirose-datasheet-145364452.pdf?src-supplier=Hirose+SCT; ComponentLink3URL: https://sigma.octopart.com:443/145364455/technical_drawing/Hirose-FH34SRJ-5S-0.5SH%2899%29.pdf?src-supplier=Hirose+SCT; ComponentLink3Description: https://sigma.octopart.com:443/145364455/technical_drawing/Hirose-FH34SRJ-5S-0.5SH%2899%29.pdf?src-supplier=Hirose+SCT; ComponentLink4URL: https://datasheet.octopart.com:443/FH34SRJ-5S-0.5SH%2899%29-Hirose-datasheet-137333288.pdf?src-supplier=Sager+Electronics; ComponentLink4Description: https://datasheet.octopart.com:443/FH34SRJ-5S-0.5SH%2899%29-Hirose-datasheet-137333288.pdf?src-supplier=Sager+Electronics
DOUT = HRS_DF63-4P-3.96DS: Supplier 1: DigiKey; Supplier Part Number 1: DF63-4P-3.96DS-ND
POS = ZE05-16DP-2H: Automotive Conn, R/A Header, 16Pos, 2A Rohs Compliant: Yes |Hirose/hrs ZE05-16DP-2H; Manufacturer: HIROSE ELECTRIC; Connector Type: Receptacle; Supplier 1: DigiKey; Supplier Part Number 1: 26-ZE05-16DP-2HCT-ND; Supplier: DigiKey; Supplier Part Number: 26-ZE05-16DP-2HCT-ND; Manufacturer Part Number: ZE05-16DP-2H; RoHS: Compliant; Category: Card Edge Connectors; Stock: 286; Pricing: 1=2,43, 10=2,068, 25=1,9384, 50=1,8458, 100=1,7576 (USD); Height: 8.84mm; Length: 28.52mm; Lifecycle Status: Production; Max Operating Temperature: 125°C; Min Operating Temperature: -40°C; Pins: 16; Orientation: Right Angle; REACH SVHC: Yes; Width: 14.8mm; ComponentLink1URL: https://datasheet.octopart.com:443/ZE05-16DP-2H-HIROSE-ELECTRIC-datasheet-180012703.pdf?src-supplier=IHS; ComponentLink1Description: https://datasheet.octopart.com:443/ZE05-16DP-2H-HIROSE-ELECTRIC-datasheet-180012703.pdf?src-supplier=IHS; ComponentLink2URL: https://datasheet.octopart.com:443/ZE05-16DP-2H-HIROSE-ELECTRIC-datasheet-189101943.pdf?src-supplier=Master+Electronics; ComponentLink2Description: https://datasheet.octopart.com:443/ZE05-16DP-2H-HIROSE-ELECTRIC-datasheet-189101943.pdf?src-supplier=Master+Electronics; ComponentLink3URL: https://datasheet.octopart.com:443/ZE05-16DP-2H-HIROSE-ELECTRIC-datasheet-188748195.pdf?src-supplier=Master+Electronics; ComponentLink3Description: https://datasheet.octopart.com:443/ZE05-16DP-2H-HIROSE-ELECTRIC-datasheet-188748195.pdf?src-supplier=Master+Electronics; ComponentLink4URL: https://datasheet.octopart.com:443/ZE05-16DP-2H-HIROSE-ELECTRIC-datasheet-181928072.pdf?src-supplier=Electro+Sonic; ComponentLink4Description: https://datasheet.octopart.com:443/ZE05-16DP-2H-HIROSE-ELECTRIC-datasheet-181928072.pdf?src-supplier=Electro+Sonic; ComponentLink5URL: https://datasheet.octopart.com:443/ZE05-16DP-2H-Hirose-datasheet-141146741.pdf?src-supplier=Hirose+SCT; ComponentLink5Description: https://datasheet.octopart.com:443/ZE05-16DP-2H-Hirose-datasheet-141146741.pdf?src-supplier=Hirose+SCT; ComponentLink6URL: https://sigma.octopart.com:443/145369985/technical_drawing/Hirose-ZE05-16DP-2H.pdf?src-supplier=Hirose+SCT; ComponentLink6Description: https://sigma.octopart.com:443/145369985/technical_drawing/Hirose-ZE05-16DP-2H.pdf?src-supplier=Hirose+SCT; ComponentLink7URL: https://datasheet.octopart.com:443/ZE05-16DP-2H-HIROSE-ELECTRIC-datasheet-176457996.pdf?src-supplier=Future+Electronics; ComponentLink7Description: https://datasheet.octopart.com:443/ZE05-16DP-2H-HIROSE-ELECTRIC-datasheet-176457996.pdf?src-supplier=Future+Electronics; ComponentLink8URL: https://datasheet.octopart.com:443/ZE05-16DP-2H-Hirose-datasheet-158236516.pdf?src-supplier=Future+Electronics; ComponentLink8Description: https://datasheet.octopart.com:443/ZE05-16DP-2H-Hirose-datasheet-158236516.pdf?src-supplier=Future+Electronics; ComponentLink9URL: https://datasheet.octopart.com:443/ZE05-16DP-2H-Hirose-datasheet-168215454.pdf?src-supplier=TME; ComponentLink9Description: https://datasheet.octopart.com:443/ZE05-16DP-2H-Hirose-datasheet-168215454.pdf?src-supplier=TME
PWR = HRS_DF63-2P-3.96DS
TH_DIN = ZE05-8DP-2H: Automotive Connectors Right Angle Receptacle, DIP Solder Tabs, 8 Position; Manufacturer: HIROSE ELECTRIC; Supplier 1: DigiKey; Supplier Part Number 1: 26-ZE05-8DP-2HCT-ND; Supplier: DigiKey; Supplier Part Number: 26-ZE05-8DP-2HCT-ND; Manufacturer Part Number: ZE05-8DP-2H; RoHS: Compliant; Category: Card Edge Connectors; Stock: 76; Pricing: 1=1,89, 10=1,609, 25=1,5084, 50=1,4362, 100=1,3676 (USD); Connector Type: Receptacle; Height: 8.84mm; Length: 18.52mm; Lifecycle Status: Production; Max Operating Temperature: 125°C; Min Operating Temperature: -40°C; Pins: 8; Orientation: Right Angle; REACH SVHC: Yes; Width: 14.8mm; ComponentLink1URL: https://datasheet.octopart.com:443/ZE05-8DP-2H-HIROSE-ELECTRIC-datasheet-180012703.pdf?src-supplier=IHS; ComponentLink1Description: https://datasheet.octopart.com:443/ZE05-8DP-2H-HIROSE-ELECTRIC-datasheet-180012703.pdf?src-supplier=IHS; ComponentLink2URL: https://datasheet.octopart.com:443/ZE05-8DP-2H-HIROSE-ELECTRIC-datasheet-189101943.pdf?src-supplier=Master+Electronics; ComponentLink2Description: https://datasheet.octopart.com:443/ZE05-8DP-2H-HIROSE-ELECTRIC-datasheet-189101943.pdf?src-supplier=Master+Electronics; ComponentLink3URL: https://datasheet.octopart.com:443/ZE05-8DP-2H-HIROSE-ELECTRIC-datasheet-188748195.pdf?src-supplier=Master+Electronics; ComponentLink3Description: https://datasheet.octopart.com:443/ZE05-8DP-2H-HIROSE-ELECTRIC-datasheet-188748195.pdf?src-supplier=Master+Electronics; ComponentLink4URL: https://datasheet.octopart.com:443/ZE05-8DP-2H-HIROSE-ELECTRIC-datasheet-181928072.pdf?src-supplier=Electro+Sonic; ComponentLink4Description: https://datasheet.octopart.com:443/ZE05-8DP-2H-HIROSE-ELECTRIC-datasheet-181928072.pdf?src-supplier=Electro+Sonic; ComponentLink5URL: https://datasheet.octopart.com:443/ZE05-8DP-2H-HIROSE-ELECTRIC-datasheet-176457996.pdf?src-supplier=Future+Electronics; ComponentLink5Description: https://datasheet.octopart.com:443/ZE05-8DP-2H-HIROSE-ELECTRIC-datasheet-176457996.pdf?src-supplier=Future+Electronics; ComponentLink6URL: https://datasheet.octopart.com:443/ZE05-8DP-2H-Hirose-datasheet-168215454.pdf?src-supplier=TME; ComponentLink6Description: https://datasheet.octopart.com:443/ZE05-8DP-2H-Hirose-datasheet-168215454.pdf?src-supplier=TME; ComponentLink7URL: https://datasheet.octopart.com:443/ZE05-8DP-2H-Hirose-datasheet-149155786.pdf?src-supplier=Sager+Electronics; ComponentLink7Description: https://datasheet.octopart.com:443/ZE05-8DP-2H-Hirose-datasheet-149155786.pdf?src-supplier=Sager+Electronics; ComponentLink8URL: https://sigma.octopart.com:443/145369997/technical_drawing/Hirose-ZE05-8DP-2H.pdf?src-supplier=Hirose+SCT; ComponentLink8Description: https://sigma.octopart.com:443/145369997/technical_drawing/Hirose-ZE05-8DP-2H.pdf?src-supplier=Hirose+SCT; ComponentLink9URL: https://datasheet.octopart.com:443/ZE05-8DP-2H-Hirose-datasheet-141146741.pdf?src-supplier=Hirose+SCT; ComponentLink9Description: https://datasheet.octopart.com:443/ZE05-8DP-2H-Hirose-datasheet-141146741.pdf?src-supplier=Hirose+SCT